# Altium schematic sheet Ethernet.SchDoc: Ethernet
size A4; Date: 2016-06-28; Author: Vitali Tsiukala; DrawnBy: Vitali Tsiukala; Engineer: Vitali Tsiukala; Organization: Trenz Electronic GmbH; DocumentNumber: TE0706; Revision: 02; SheetNumber: 4; SheetTotal: 10
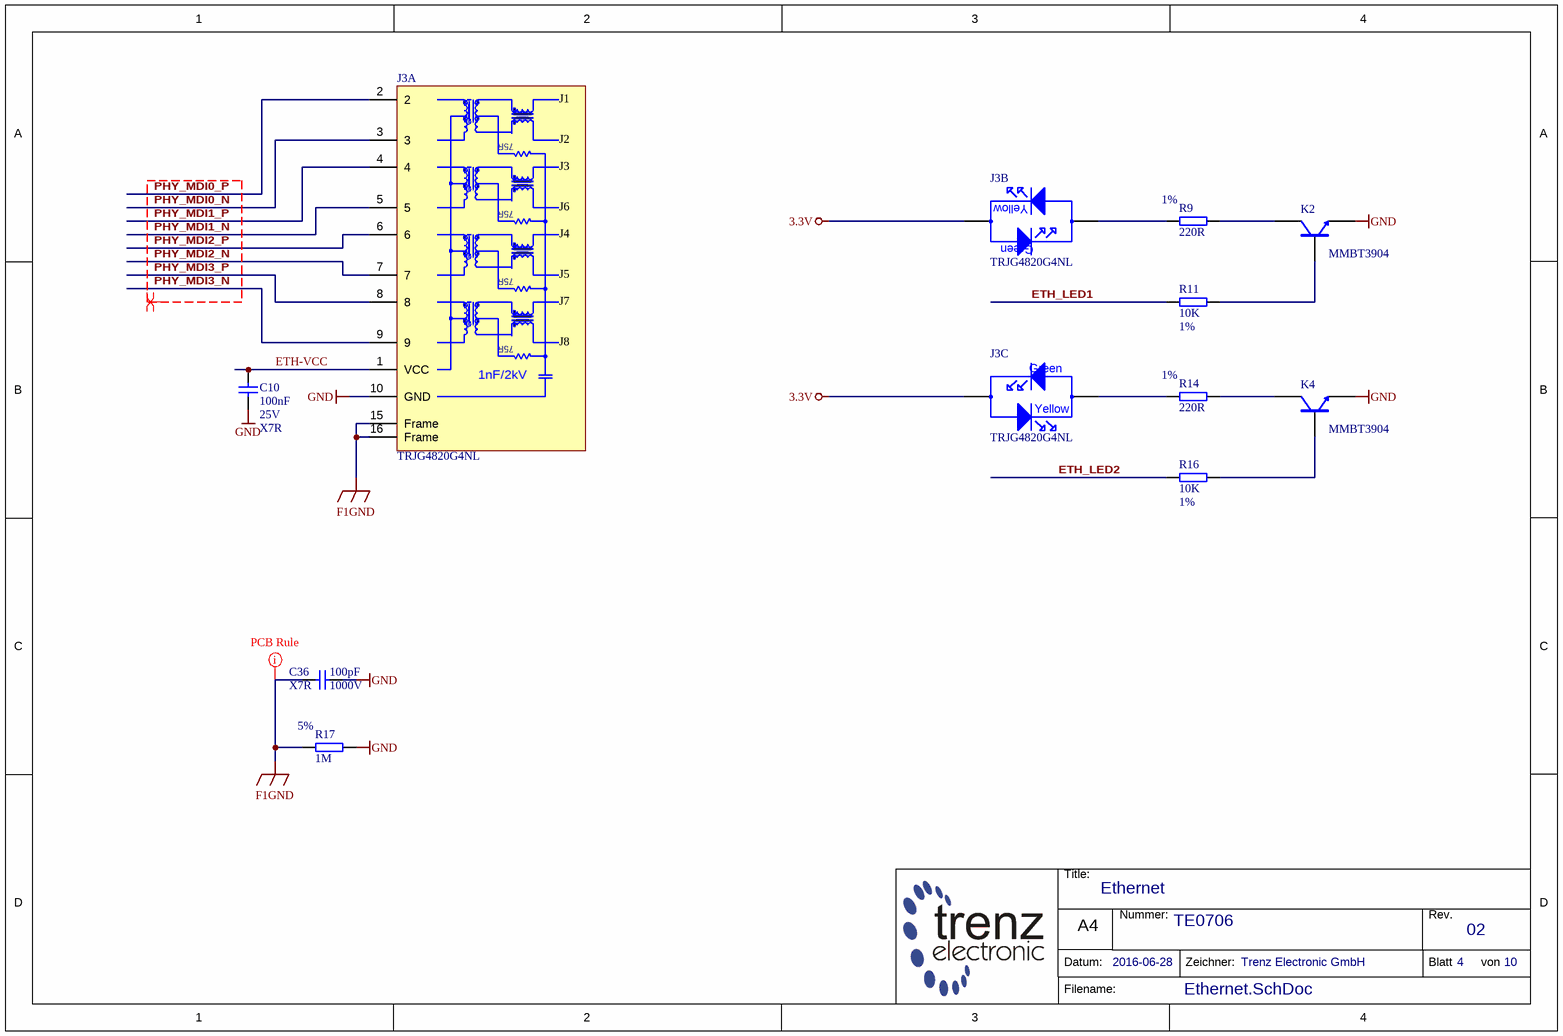
[diagram p0: Ethernet.SchDoc]

## Parts
C10  100nF  Voltage: 25V  Technology: X7R  [CAPC1005X55N]
C36  100pF  Voltage: X7R  Technology: 1000V  [CAPC3216X180N]
J3  TRJG4820G4NL  [MIC38013-5151T-LF3]  (parts A,B,C of 3)
K2  MMBT3904  [SOT95P280X145-3N]
K4  MMBT3904  [SOT95P280X145-3N]
R9  220R  Tolerance: 1%  [RESC1005X40N]
R11  10K  Tolerance: 1%  [RESC1005X40N]
R14  220R  Tolerance: 1%  [RESC1005X40N]
R16  10K  Tolerance: 1%  [RESC1005X40N]
R17  1M  Tolerance: 5%  [RESC3216X65N]

## Nets
3.3V: J3.11(GREEN) J3.14(YELLOW)
F1GND: C36.1 J3.15(Frame) J3.16(Frame) R17.1
GND: C10.1 C36.2 J3.10(GND) K2.2(EMITTER) K4.2(EMITTER) R17.2
ETH-VCC: C10.2 J3.1(VCC)
ETH_LED1: R11.1
ETH_LED2: R16.1
PHY_MDI0_N: J3.3
PHY_MDI0_P: J3.2
PHY_MDI1_N: J3.5
PHY_MDI1_P: J3.4
PHY_MDI2_N: J3.7
PHY_MDI2_P: J3.6
PHY_MDI3_N: J3.9
PHY_MDI3_P: J3.8
NetJ3_12: J3.12(YELLOW) R9.1
NetJ3_13: J3.13(GREEN) R14.1
NetK2_1: K2.1(BASIS) R11.2
NetK2_3: K2.3(COLLECTOR) R9.2
NetK4_1: K4.1(BASIS) R16.2
NetK4_3: K4.3(COLLECTOR) R14.2

## Layout directives
rule Clearance Constraint [Clearance = 0.5mm]: F1GND
differential pair: PHY_MDI0_N, PHY_MDI0_P, PHY_MDI1_N, PHY_MDI1_P, PHY_MDI2_N, PHY_MDI2_P, PHY_MDI3_N, PHY_MDI3_P

## Notes on the sheet
- Title:
- Nummer:
- Rev.
- Datum:
- A4
- Zeichner:
- Blatt
- von
- Filename:
- (in symbol 27357, part A) J1; 75R; J2; J6; J4; J5; J7; J8; 1nF/2kV
- (in symbol 27357, part B) Yellow; Green
- (in symbol 27357, part C) Green; Yellow

## Library data of the parts
C10 = 22472: KON 100nF 25V X5R SMD; AN: 22472; Value: 100n; Mixed: SMT; Preferred: Yes; Case: 1005 (0402)
C36 = 22679: KON 100pF 1000V X7R 10%; AN: 22679; Value: 100p; Preferred: Yes; Mixed: SMT; Case: 3216 (1206); Tolerance: 10%
J3 = 27357: LAN-Transformer 10/100/1000 BaseT; AN: 27357; Trenz-Stock: Yes; Mixed: THT; HelpURL: B:\ad\adlib\datasheet\TRJG4820G4NL; Technology: -40 to +85 °C; H-ART: TRJG4820G4NL
K2 K4 = 23806: AN: 23806; Mixed: SMT; Trenz-Stock: Yes; Case: SOT23-3; HelpURL: B:\AD\adlib\datasheet\MMBT3904; Preferred: Yes; H-ART: MMBT3904
R9 R14 = 22767: WID SMD 220R 1% 0,063W; AN: 22767; Mixed: SMT; Value: 220; Preferred: Yes; Case: 1005 (0402); Technology: TK100
R11 R16 = 22750: WID SMD 10K 1% 0,063W; AN: 22750; Mixed: SMT; Preferred: Yes; Case: 1005 (0402); Value: 10K; Technology: TK100
R17 = 22757: WID SMD 1M 5% 0,25W; AN: 22757; Mixed: SMT; Preferred: Yes; Case: 3216 (1206); Value: 1M; Technology: TK100